# EAGLE schematic adapter (EAGLE 6.5.0)
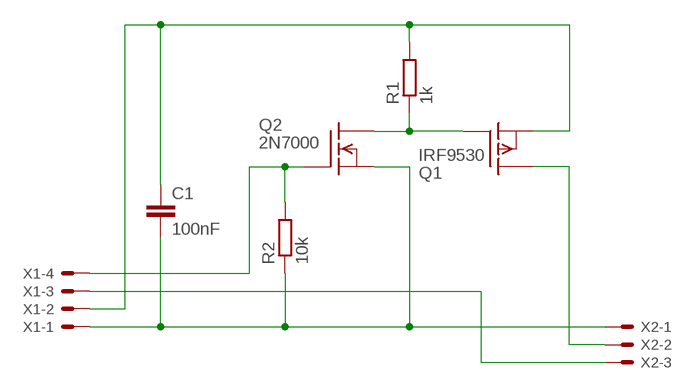
[diagram p0: schematic, sheet 1]

## Parts
C1  100nF  C-EU050-030X075  [C050-030X075]
Q1  IRF9530  [TO220]
Q2  2N7000  BSS101  [TO92]
R1  1k  R-EU_0207/10  [0207/10]
R2  10k  R-EU_0207/10  [0207/10]
X1  KK-156-4  [KK-156-4]
X2  KK-156-3  [KK-156-3]

## Nets
N$1: C1.2 Q2.1(S) R2.1 X1.1 X2.1
N$2: X1.3 X2.3
N$3: Q2.2(G) R2.2 X1.4
N$4: Q1.2(D) X2.2
N$5: C1.1 Q1.3(S) R1.2 X1.2
N$7: Q1.1(G) Q2.3(D) R1.1

## Library data of the parts
C1 = rcl:C-EU: CAPACITOR, European symbol
Q1 = transistor-fet:IRF9530: P-Channel Enhancement MOSFET (HEXFET); -100V; -12A; 0,3Ohm
Q2 = transistor-fet:BSS101: N-Channel Enhancement MOSFET 200V; 0,16A; 11Ohm
R1 R2 = resistor:R-EU_: RESISTOR, European symbol
X1 = con-molex:KK-156-4: KK 156 HEADER Source: http://www.molex.com/pdm_docs/sd/026604100_sd.pdf; OC_FARNELL: unknown; OC_NEWARK: unknown
X2 = con-molex:KK-156-3: KK 156 HEADER Source: http://www.molex.com/pdm_docs/sd/026604100_sd.pdf; OC_FARNELL: unknown; OC_NEWARK: unknown